# EAGLE board RelayBoard (EAGLE 9.6.2)
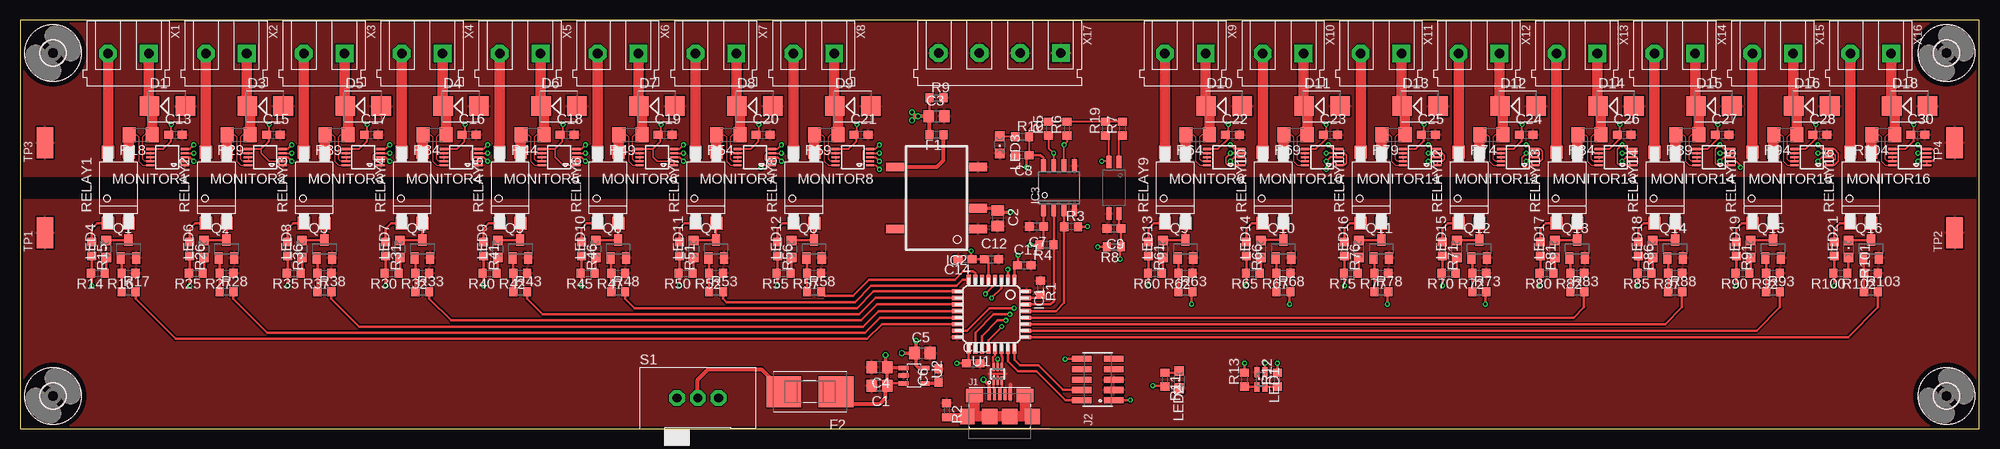
[diagram p9: board, top side]
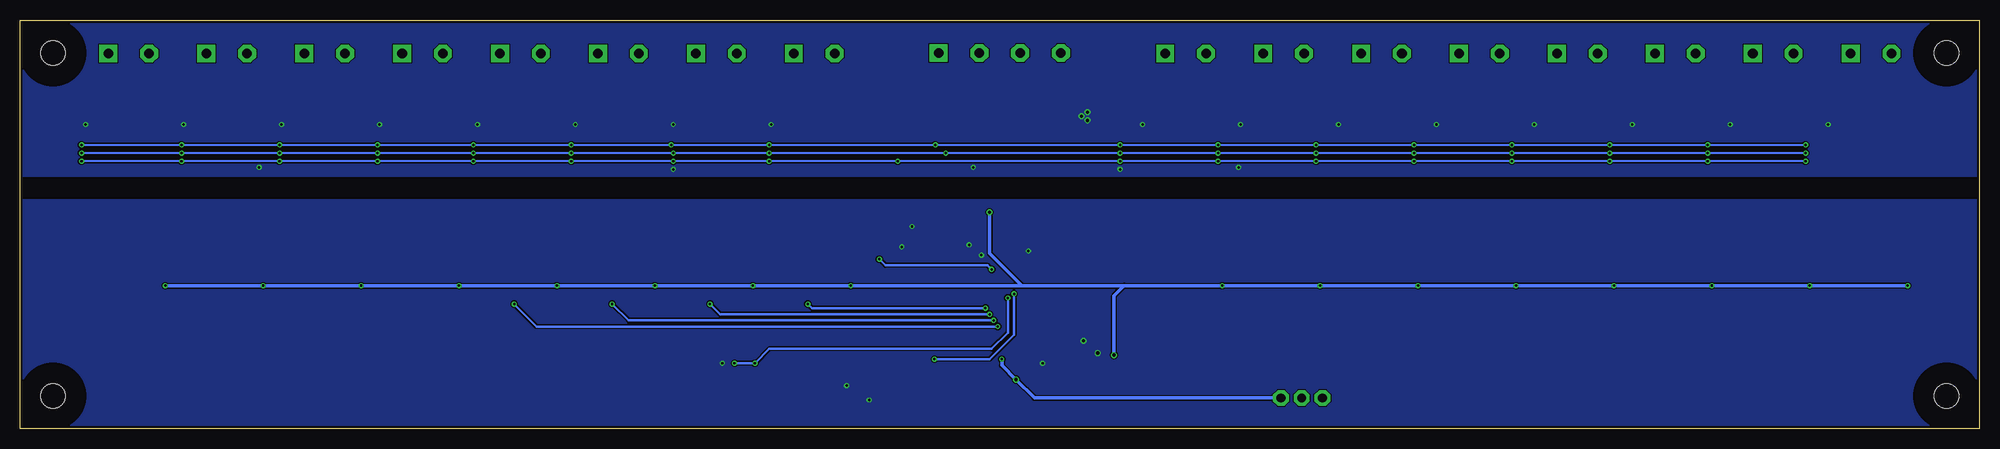
[diagram p10: board, bottom side, seen from below]

Size 240 x 50 mm. Coordinates in mm from the lower left corner, seen from the top.
Outline: 0,0 240,0 240,50 0,50 0,0
Copper layers (1*16): Top 0.035mm / dielectric 1.5mm / Bottom 0.035mm
Design rules "PCB-POOL Standard": minimum track width 0.15mm, minimum drill 0.3mm, track to track 0.15mm, track to pad 0.15mm, pad to pad 0.15mm, via to via 0.15mm, smd to smd 0.15mm, copper to edge 0.3mm, drill to drill 0.2mm, minimum pad ring 0.2mm, minimum via ring 0.15mm, stop-mask expansion 0.03mm, vias tented up to drill 0mil, thermal gap 0.2mm

## Footprints (pad centres in the part's own frame; a part is rotated, then mirrored left to right if it is on the bottom)
C0805 = smd 1.3 x 1.5: 1 -0.95,0; 2 0.95,0
C0603 = smd 1.1 x 1: 1 -0.85,0; 2 0.85,0
SMB = smd 2.4 x 2.4: A 2.2,0; C -2.2,0
R0603 = smd 1 x 1.1: 1 -0.85,0; 2 0.85,0
NANO2_SMF_FUSEBLOCK = smd 4.24 x 3.81: 1 -3.19,0; 2 3.19,0
3,0 = hole 3: 0,0
LQFP32 = smd 0.5 x 1.2: 1 -2.8,-4.25; 2 -2,-4.25; 3 -1.2,-4.25; 4 -0.4,-4.25; 5 0.4,-4.25; 6 1.2,-4.25; 7 2,-4.25; 8 2.8,-4.25; 17 2.8,4.25; 18 2,4.25; 19 1.2,4.25; 20 0.4,4.25; 21 -0.4,4.25; 22 -1.2,4.25; 23 -2,4.25; 24 -2.8,4.25 | smd 1.2 x 0.5: 9 4.25,-2.8; 10 4.25,-2; 11 4.25,-1.2; 12 4.25,-0.4; 13 4.25,0.4; 14 4.25,1.2; 15 4.25,2; 16 4.25,2.8; 25 -4.25,2.8; 26 -4.25,2; 27 -4.25,1.2; 28 -4.25,0.4; 29 -4.25,-0.4; 30 -4.25,-1.2; 31 -4.25,-2; 32 -4.25,-2.8
PESE1-M = smd 1.067 x 2.184: 1 -3.81,-5.08; 2 -1.27,-5.08; 4 3.81,-5.08; 5 3.81,5.08; 8 -3.81,5.08
SOIC8 = smd 1.55 x 0.6: 1 -2.7,1.905; 2 -2.7,0.635; 3 -2.7,-0.635; 4 -2.7,-1.905; 5 2.7,-1.905; 6 2.7,-0.635; 7 2.7,0.635; 8 2.7,1.905
4-MINI-FLAT = smd 1.524 x 0.61: 1 -3.175,0.635; 2 -3.175,-0.635; 3 3.175,-0.635; 4 3.175,0.635
HRS_ZX62-B-5PA(33) = smd 0.4 x 1.35: 1 -1.3,2.675; 2 -0.65,2.675; 3 0,2.675; 4 0.65,2.675; 5 1.3,2.675 | smd 2.1 x 1.6: SH1 -3.1,2.55; SH6 3.1,2.55 | smd 1.8 x 1.9: SH2 -4,0; SH5 4,0 | smd 1.9 x 1.9: SH3 -1.2,0; SH4 1.2,0
62101021021 = smd 0.75 x 2.4: 1 -2.54,-1.95; 2 -2.54,1.95; 3 -1.27,-1.95; 4 -1.27,1.95; 5 0,-1.95; 6 0,1.95; 7 1.27,-1.95; 8 1.27,1.95; 9 2.54,-1.95; 10 2.54,1.95
CHIPLEDX2 = smd 0.6 x 1.2: A1 -0.475,0.9; A2 0.475,0.9; C1 -0.475,-0.9; C2 0.475,-0.9
CHIPLED_0805 = smd 1.2 x 1.2: A 0,-1.05; C 0,1.05
MSOP10 = smd 0.25 x 1: 1 -1,-2.113; 2 -0.5,-2.113; 3 0,-2.113; 4 0.5,-2.113; 5 1,-2.113; 6 1,2.113; 7 0.5,2.113; 8 0,2.113; 9 -0.5,2.113; 10 -1,2.113
SOT23 = smd 1 x 1.4: 1 -0.95,-1.1; 2 0.95,-1.1; 3 0,1.1
R1206 = smd 1.6 x 1.803: 1 -1.422,0; 2 1.422,0
TP1/5 = smd 1.5 x 1.6: P$1 -1.27,-4.35; P$2 1.27,-4.35; P$3 1.27,4.35; P$4 -1.27,4.35
2533XN = drill 1.092 pad 1.93 octagon: 1 -2.54,0; 2 0,0; 3 2.54,0
3.8X2.03 = smd 3.8 x 2.03: TP 0,0
SOT-666 = smd 0.3 x 1: 1 -0.5,-0.81; 2 0,-0.81; 3 0.5,-0.81; 4 0.5,0.81; 5 0,0.81; 6 -0.5,0.81
SOT23-5 = smd 0.55 x 1.2: 1 -0.95,-1.3; 2 0,-1.3; 3 0.95,-1.3; 4 0.95,1.3; 5 -0.95,1.3
AKL055-2 = drill 1.168 pad 2.184 square: 1 2.525,4.045 | drill 1.168 pad 2.184 octagon: 2 7.525,4.045
AKL055-4 = drill 1.168 pad 2.184 square: 1 2.5,4 | drill 1.168 pad 2.184 octagon: 2 7.5,4; 3 12.5,4; 4 17.5,4

## Placement (x,y rotation side)
C1  10µ  [C0805]  105.25,5.25 180 top
C2  4.7µ  [C0805]  119.75,25.75 270 top
C3  10µ  [C0805]  112.25,38.25 0 top
C4  1µ  [C0805]  105.25,7.5 180 top
C5  4.7µ  [C0805]  110.5,9.25 0 top
C6  10n  [C0603]  112.5,6.5 90 top
C7  100n  [C0603]  124.5,24.75 180 top
C8  100n  [C0603]  122.75,33.5 180 top
C9  100n  [C0603]  134,24.5 180 top
C10  100n  [C0603]  116.75,8 0 top
C11  100n  [C0603]  123,20 0 top
C12  100n  [C0603]  119,20.75 0 top
C13  100n  [C0603]  19,36 0 top
C14  1µ  [C0603]  115.75,20.75 180 top
C15  100n  [C0603]  31,36 0 top
C16  100n  [C0603]  55,36 0 top
C17  100n  [C0603]  43,36 0 top
C18  100n  [C0603]  67,36 0 top
C19  100n  [C0603]  79,36 0 top
C20  100n  [C0603]  91,36 0 top
C21  100n  [C0603]  103,36 0 top
C22  100n  [C0603]  148.5,36 0 top
C23  100n  [C0603]  160.5,36 0 top
C24  100n  [C0603]  184.5,36 0 top
C25  100n  [C0603]  172.5,36 0 top
C26  100n  [C0603]  196.5,36 0 top
C27  100n  [C0603]  208.5,36 0 top
C28  100n  [C0603]  220.5,36 0 top
C30  100n  [C0603]  232.5,36 0 top
D1  60V, 2A  [SMB]  18,39.5 0 top
D3  60V, 2A  [SMB]  30,39.5 0 top
D4  60V, 2A  [SMB]  54,39.5 0 top
D5  60V, 2A  [SMB]  42,39.5 0 top
D6  60V, 2A  [SMB]  66,39.5 0 top
D7  60V, 2A  [SMB]  78,39.5 0 top
D8  60V, 2A  [SMB]  90,39.5 0 top
D9  60V, 2A  [SMB]  102,39.5 0 top
D10  60V, 2A  [SMB]  147.5,39.5 0 top
D11  60V, 2A  [SMB]  159.5,39.5 0 top
D12  60V, 2A  [SMB]  183.5,39.5 0 top
D13  60V, 2A  [SMB]  171.5,39.5 0 top
D14  60V, 2A  [SMB]  195.5,39.5 0 top
D15  60V, 2A  [SMB]  207.5,39.5 0 top
D16  60V, 2A  [SMB]  219.5,39.5 0 top
D18  60V, 2A  [SMB]  231.5,39.5 0 top
F1  250m  [R0603]  112.25,36 180 top
F2  SMF_OMNIBLOK_154.400  [NANO2_SMF_FUSEBLOCK]  96.75,4.5 180 top
H1  MOUNT-HOLE3.0  [3,0]  236,46 0 top
H2  MOUNT-HOLE3.0  [3,0]  236,4 0 top
H3  MOUNT-HOLE3.0  [3,0]  4,4 0 top
H4  MOUNT-HOLE3.0  [3,0]  4,46 0 top
IC1  STM32L412KBT6  [LQFP32]  119,14 180 top
IC2  PESE1-S5-S3-M  [PESE1-M]  112.25,28.25 90 top
IC3  ISO1541  [SOIC8]  127.25,29.5 90 top
IC4  HMHA281  [4-MINI-FLAT]  134,29.5 270 top
J1  ZX62-B-5PA(33)  [HRS_ZX62-B-5PA(33)]  120,1.5 0 top
J2  [62101021021]  132,6 90 top
LED1  DUAL0805  [CHIPLEDX2]  152,6 180 top
LED2  GREEN  [CHIPLED_0805]  142,6 180 top
LED3  GREEN  [CHIPLED_0805]  120,34.75 180 top
LED4  YELLOW  [CHIPLED_0805]  10.5,22 0 top
LED6  YELLOW  [CHIPLED_0805]  22.5,22 0 top
LED7  YELLOW  [CHIPLED_0805]  46.5,22 0 top
LED8  YELLOW  [CHIPLED_0805]  34.5,22 0 top
LED9  YELLOW  [CHIPLED_0805]  58.5,22 0 top
LED10  YELLOW  [CHIPLED_0805]  70.5,22 0 top
LED11  YELLOW  [CHIPLED_0805]  82.5,22 0 top
LED12  YELLOW  [CHIPLED_0805]  94.5,22 0 top
LED13  YELLOW  [CHIPLED_0805]  140,22 0 top
LED14  YELLOW  [CHIPLED_0805]  152,22 0 top
LED15  YELLOW  [CHIPLED_0805]  176,22 0 top
LED16  YELLOW  [CHIPLED_0805]  164,22 0 top
LED17  YELLOW  [CHIPLED_0805]  188,22 0 top
LED18  YELLOW  [CHIPLED_0805]  200,22 0 top
LED19  YELLOW  [CHIPLED_0805]  212,22 0 top
LED21  YELLOW  [CHIPLED_0805]  224,22 0 top
MONITOR1  INA226  [MSOP10]  18,33.25 90 top
MONITOR2  INA226  [MSOP10]  30,33.25 90 top
MONITOR3  INA226  [MSOP10]  42,33.25 90 top
MONITOR4  INA226  [MSOP10]  54,33.25 90 top
MONITOR5  INA226  [MSOP10]  66,33.25 90 top
MONITOR6  INA226  [MSOP10]  78,33.25 90 top
MONITOR7  INA226  [MSOP10]  90,33.25 90 top
MONITOR8  INA226  [MSOP10]  102,33.25 90 top
MONITOR9  INA226  [MSOP10]  147.5,33.25 90 top
MONITOR10  INA226  [MSOP10]  159.5,33.25 90 top
MONITOR11  INA226  [MSOP10]  171.5,33.25 90 top
MONITOR12  INA226  [MSOP10]  183.5,33.25 90 top
MONITOR13  INA226  [MSOP10]  195.5,33.25 90 top
MONITOR14  INA226  [MSOP10]  207.5,33.25 90 top
MONITOR15  INA226  [MSOP10]  219.5,33.25 90 top
MONITOR16  INA226  [MSOP10]  231.5,33.25 90 top
Q1  BSS138  [SOT23]  13.25,22 0 top
Q2  BSS138  [SOT23]  25.25,22 0 top
Q3  BSS138  [SOT23]  37.25,22 0 top
Q4  BSS138  [SOT23]  49.25,22 0 top
Q5  BSS138  [SOT23]  61.25,22 0 top
Q6  BSS138  [SOT23]  73.25,22 0 top
Q7  BSS138  [SOT23]  85.25,22 0 top
Q8  BSS138  [SOT23]  97.25,22 0 top
Q9  BSS138  [SOT23]  142.75,22 0 top
Q10  BSS138  [SOT23]  154.75,22 0 top
Q11  BSS138  [SOT23]  166.75,22 0 top
Q12  BSS138  [SOT23]  178.75,22 0 top
Q13  BSS138  [SOT23]  190.75,22 0 top
Q14  BSS138  [SOT23]  202.75,22 0 top
Q15  BSS138  [SOT23]  214.75,22 0 top
Q16  BSS138  [SOT23]  226.75,22 0 top
R1  10k  [R0603]  125,17.25 270 top
R2  1M  [R0603]  113.5,2.25 270 top
R3  4.7k  [R0603]  128.75,24.75 0 top
R4  4.7k  [R0603]  125.75,22.5 180 top
R5  4.7k  [R0603]  126,36.75 90 top
R6  4.7k  [R0603]  128.25,36.75 90 top
R7  200  [R0603]  135.05,36.75 90 top
R8  10k  [R0603]  134,22.25 180 top
R9  100  [R0603]  112.25,40.5 0 top
R10  200  [R0603]  122.75,35.75 0 top
R11  200  [R0603]  140.25,6 270 top
R12  200  [R0603]  154,6 90 top
R13  200  [R0603]  150,6 90 top
R14  499  [R0603]  9.5,19 180 top
R15  499  [R0603]  8.75,22 270 top
R16  10k  [R0603]  13.25,19 180 top
R17  100  [R0603]  13.25,16.75 0 top
R18  25m  [R1206]  14.75,36 180 top
R19  10k  [R0603]  132.95,36.75 90 top
R25  499  [R0603]  21.5,19 180 top
R26  499  [R0603]  20.75,22 270 top
R27  10k  [R0603]  25.25,19 180 top
R28  100  [R0603]  25.25,16.75 0 top
R29  25m  [R1206]  26.75,36 180 top
R30  499  [R0603]  45.5,19 180 top
R31  499  [R0603]  44.75,22 270 top
R32  10k  [R0603]  49.25,19 180 top
R33  100  [R0603]  49.25,16.75 0 top
R34  25m  [R1206]  50.75,36 180 top
R35  499  [R0603]  33.5,19 180 top
R36  499  [R0603]  32.75,22 270 top
R37  10k  [R0603]  37.25,19 180 top
R38  100  [R0603]  37.25,16.75 0 top
R39  25m  [R1206]  38.75,36 180 top
R40  499  [R0603]  57.5,19 180 top
R41  499  [R0603]  56.75,22 270 top
R42  10k  [R0603]  61.25,19 180 top
R43  100  [R0603]  61.25,16.75 0 top
R44  25m  [R1206]  62.75,36 180 top
R45  499  [R0603]  69.5,19 180 top
R46  499  [R0603]  68.75,22 270 top
R47  10k  [R0603]  73.25,19 180 top
R48  100  [R0603]  73.25,16.75 0 top
R49  25m  [R1206]  74.75,36 180 top
R50  499  [R0603]  81.5,19 180 top
R51  499  [R0603]  80.75,22 270 top
R52  10k  [R0603]  85.25,19 180 top
R53  100  [R0603]  85.25,16.75 0 top
R54  25m  [R1206]  86.75,36 180 top
R55  499  [R0603]  93.5,19 180 top
R56  499  [R0603]  92.75,22 270 top
R57  10k  [R0603]  97.25,19 180 top
R58  100  [R0603]  97.25,16.75 0 top
R59  25m  [R1206]  98.75,36 180 top
R60  499  [R0603]  139,19 180 top
R61  499  [R0603]  138.25,22 270 top
R62  10k  [R0603]  142.75,19 180 top
R63  100  [R0603]  142.75,16.75 0 top
R64  25m  [R1206]  144.25,36 180 top
R65  499  [R0603]  151,19 180 top
R66  499  [R0603]  150.25,22 270 top
R67  10k  [R0603]  154.75,19 180 top
R68  100  [R0603]  154.75,16.75 0 top
R69  25m  [R1206]  156.25,36 180 top
R70  499  [R0603]  175,19 180 top
R71  499  [R0603]  174.25,22 270 top
R72  10k  [R0603]  178.75,19 180 top
R73  100  [R0603]  178.75,16.75 0 top
R74  25m  [R1206]  180.25,36 180 top
R75  499  [R0603]  163,19 180 top
R76  499  [R0603]  162.25,22 270 top
R77  10k  [R0603]  166.75,19 180 top
R78  100  [R0603]  166.75,16.75 0 top
R79  25m  [R1206]  168.25,36 180 top
R80  499  [R0603]  187,19 180 top
R81  499  [R0603]  186.25,22 270 top
R82  10k  [R0603]  190.75,19 180 top
R83  100  [R0603]  190.75,16.75 0 top
R84  25m  [R1206]  192.25,36 180 top
R85  499  [R0603]  199,19 180 top
R86  499  [R0603]  198.25,22 270 top
R87  10k  [R0603]  202.75,19 180 top
R88  100  [R0603]  202.75,16.75 0 top
R89  25m  [R1206]  204.25,36 180 top
R90  499  [R0603]  211,19 180 top
R91  499  [R0603]  210.25,22 270 top
R92  10k  [R0603]  214.75,19 180 top
R93  100  [R0603]  214.75,16.75 0 top
R94  25m  [R1206]  216.25,36 180 top
R100  499  [R0603]  223,19 180 top
R101  499  [R0603]  222.25,22 270 top
R102  10k  [R0603]  226.75,19 180 top
R103  100  [R0603]  226.75,16.75 0 top
R104  25m  [R1206]  228.25,36 180 top
RELAY1  TLP241A(LF1,TP1)  [TP1/5]  12,29.5 0 top
RELAY2  TLP241A(LF1,TP1)  [TP1/5]  24,29.5 0 top
RELAY3  TLP241A(LF1,TP1)  [TP1/5]  36,29.5 0 top
RELAY4  TLP241A(LF1,TP1)  [TP1/5]  48,29.5 0 top
RELAY5  TLP241A(LF1,TP1)  [TP1/5]  60,29.5 0 top
RELAY6  TLP241A(LF1,TP1)  [TP1/5]  72,29.5 0 top
RELAY7  TLP241A(LF1,TP1)  [TP1/5]  84,29.5 0 top
RELAY8  TLP241A(LF1,TP1)  [TP1/5]  96,29.5 0 top
RELAY9  TLP241A(LF1,TP1)  [TP1/5]  141.5,29.5 0 top
RELAY10  TLP241A(LF1,TP1)  [TP1/5]  153.5,29.5 0 top
RELAY11  TLP241A(LF1,TP1)  [TP1/5]  165.5,29.5 0 top
RELAY12  TLP241A(LF1,TP1)  [TP1/5]  177.5,29.5 0 top
RELAY13  TLP241A(LF1,TP1)  [TP1/5]  189.5,29.5 0 top
RELAY14  TLP241A(LF1,TP1)  [TP1/5]  201.5,29.5 0 top
RELAY15  TLP241A(LF1,TP1)  [TP1/5]  213.5,29.5 0 top
RELAY16  TLP241A(LF1,TP1)  [TP1/5]  225.5,29.5 0 top
S1  25336N  [2533XN]  83,3.75 0 top
TP1  TP3.8X2.03  [3.8X2.03]  3,24 90 top
TP2  TP3.8X2.03  [3.8X2.03]  237,24 90 top
TP3  TP3.8X2.03  [3.8X2.03]  3,35 90 top
TP4  TP3.8X2.03  [3.8X2.03]  237,35 90 top
U1  USBLC6-2P6  [SOT-666]  119.75,6.7 0 top
U2  LP2985IM5-3.3  [SOT23-5]  109.5,6.5 270 top
X1  AKL055-2  [AKL055-2]  18.25,50 180 top
X2  AKL055-2  [AKL055-2]  30.25,50 180 top
X3  AKL055-2  [AKL055-2]  42.25,50 180 top
X4  AKL055-2  [AKL055-2]  54.25,50 180 top
X5  AKL055-2  [AKL055-2]  66.25,50 180 top
X6  AKL055-2  [AKL055-2]  78.25,50 180 top
X7  AKL055-2  [AKL055-2]  90.25,50 180 top
X8  AKL055-2  [AKL055-2]  102.25,50 180 top
X9  AKL055-2  [AKL055-2]  147.75,50 180 top
X10  AKL055-2  [AKL055-2]  159.75,50 180 top
X11  AKL055-2  [AKL055-2]  171.75,50 180 top
X12  AKL055-2  [AKL055-2]  183.75,50 180 top
X13  AKL055-2  [AKL055-2]  195.75,50 180 top
X14  AKL055-2  [AKL055-2]  207.75,50 180 top
X15  AKL055-2  [AKL055-2]  219.75,50 180 top
X16  AKL055-2  [AKL055-2]  231.75,50 180 top
X17  AKL055-4  [AKL055-4]  130,50 180 top

## Tracks (layer width: path | path; a pad name or v marks a point on that pad's centre or on a via)
!ALERT  (via drill 0.3)
  Top 0.305: IC4.4 134.63,24.71 C9.1 R8.1 134.75,22.15 v134.75,20.75 | IC1.2 v121,19.5
  Bottom 0.305: v121,19.5 121.5,20 134,20 v134.75,20.75
!ALERTISO  (via drill 0.3)
  Top 0.254: MONITOR8.3 104.75,33.25 v105.25,32.75 | MONITOR1.3 20.75,33.25 v21.25,32.75 | v232.5,32.75 233,33.25 MONITOR16.3 | MONITOR15.3 220.75,33.25 v220.25,32.75 | MONITOR14.3 208.75,33.25 v208.25,32.75 | MONITOR13.3 196.75,33.25 v196.25,32.75 | MONITOR12.3 185,33.25 v184.5,32.75 | MONITOR11.3 173,33.25 v172.5,32.75 | MONITOR10.3 160.5,33.25 v160,32.75 | MONITOR9.3 148.75,33.25 v148.25,32.75 | MONITOR7.3 92.75,33.25 v93.25,32.75 | MONITOR6.3 80.75,33.25 v81.25,32.75 | MONITOR5.3 68.75,33.25 v69.25,32.75 | MONITOR4.3 56.75,33.25 v57.25,32.75 | MONITOR3.3 44.75,33.25 v45.25,32.75 | MONITOR2.3 32.75,33.25 v33.25,32.75 | R19.1 133.37,35.48 IC4.2 133.29,32.75 v132.5,32.75
  Bottom 0.254: v21.25,32.75 v33.25,32.75 v45.25,32.75 v57.25,32.75 v69.25,32.75 v81.25,32.75 v93.25,32.75 v105.25,32.75 v132.5,32.75 v148.25,32.75 v160,32.75 v172.5,32.75 v184.5,32.75 v196.25,32.75 v208.25,32.75 v220.25,32.75 v232.5,32.75
!NRST  (via drill 0.3)
  Top 0.305: IC1.4 119.4,17.65 v118.25,16.5 | v128,8.5 128.04,8.54 J2.10
  Bottom 0.305: v118.25,16.5 118.25,11.5 121.25,8.5 v128,8.5
GND
  Top 0.305: U1.2 119.75,6.71 | 119.75,6.71 120.75,6.71 | 119.75,6.71 118.71,6.71
  Top 0.406: J1.5 121.3,5.45
  pour Top: 0,0 0,28 240,28 240,0
GNDISO
  pour Top: 0,50 0,31 240,31 240,50
LOAD1
  Top 0.15: R18.1 15.25,36 15,35.75 15,33 15.25,32.75 MONITOR1.9 MONITOR1.8
  Top 1.27: X1.1 15.72,39.58 D1.C 16.17,39.13 R18.1
LOAD2
  Top 0.15: R29.1 27.25,36 27,35.75 27,33 27.25,32.75 MONITOR2.9 MONITOR2.8
  Top 1.27: R29.1 28.17,39.13 D3.C 27.73,39.58 X2.1
LOAD3
  Top 0.15: R39.1 39.25,36 39,35.75 39,33 39.25,32.75 MONITOR3.9 MONITOR3.8
  Top 1.27: X3.1 39.73,39.58 D5.C 40.17,39.13 R39.1
LOAD4
  Top 0.15: R34.1 51.25,36 51,35.75 51,33 51.25,32.75 MONITOR4.9 MONITOR4.8
  Top 1.27: R34.1 52.17,39.13 D4.C 51.73,39.58 X4.1
LOAD5
  Top 0.15: R44.1 63.25,36 63,35.75 63,33 63.25,32.75 MONITOR5.9 MONITOR5.8
  Top 1.27: X5.1 63.73,39.58 D6.C 64.17,39.13 R44.1
LOAD6
  Top 0.15: R49.1 75.25,36 75,35.75 75,33 75.25,32.75 MONITOR6.9 MONITOR6.8
  Top 1.27: X6.1 75.72,39.58 D7.C 76.17,39.13 R49.1
LOAD7
  Top 0.15: R54.1 87.25,36 87,35.75 87,33 87.25,32.75 MONITOR7.9 MONITOR7.8
  Top 1.27: X7.1 87.72,39.58 D8.C 88.17,39.13 R54.1
LOAD8
  Top 0.15: R59.1 99.25,36 99,35.75 99,33 99.25,32.75 MONITOR8.9 MONITOR8.8
  Top 1.27: R59.1 100.17,39.13 D9.C 99.72,39.58 X8.1
LOAD9
  Top 0.15: R64.1 144.75,36 144.5,35.75 144.5,33 144.75,32.75 MONITOR9.9 MONITOR9.8
  Top 1.27: R64.1 145.67,39.13 D10.C 145.22,39.58 X9.1
LOAD10
  Top 0.15: R69.1 156.75,36 156.5,35.75 156.5,33 156.75,32.75 MONITOR10.9 MONITOR10.8
  Top 1.27: X10.1 157.22,39.58 D11.C 157.67,39.13 R69.1
LOAD11
  Top 0.15: R79.1 168.75,36 168.5,35.75 168.5,33 168.75,32.75 MONITOR11.9 MONITOR11.8
  Top 1.27: X11.1 169.22,39.58 D13.C 169.67,39.13 R79.1
LOAD12
  Top 0.15: R74.1 180.75,36 180.5,35.75 180.5,33 180.75,32.75 MONITOR12.9 MONITOR12.8
  Top 1.27: X12.1 181.22,39.58 D12.C 181.67,39.13 R74.1
LOAD13
  Top 0.15: R84.1 192.75,36 192.5,35.75 192.5,33 192.75,32.75 MONITOR13.9 MONITOR13.8
  Top 1.27: R84.1 193.67,39.13 D14.C 193.22,39.58 X13.1
LOAD14
  Top 0.15: R89.1 204.75,36 204.5,35.75 204.5,33 204.75,32.75 MONITOR14.9 MONITOR14.8
  Top 1.27: R89.1 205.67,39.13 D15.C 205.22,39.58 X14.1
LOAD15
  Top 0.15: R94.1 216.75,36 216.5,35.75 216.5,33 216.75,32.75 MONITOR15.9 MONITOR15.8
  Top 1.27: X15.1 217.22,39.58 D16.C 217.67,39.13 R94.1
LOAD16
  Top 0.15: R104.1 228.75,36 228.5,35.75 228.5,33 228.75,32.75 MONITOR16.9 MONITOR16.8
  Top 1.27: R104.1 229.67,39.13 D18.C 229.22,39.58 X16.1
N$1
  Top 0.305: J1.2 119.35,4.9 119.25,5 U1.1
N$2
  Top 0.305: J1.3 120,4.86 120.25,5.11 U1.3
N$3
  Top 1.016: R2.2 115.9,1.4 J1.SH2
  Top 1.27: J1.SH1 116.9,2.4 J1.SH2 J1.SH3 J1.SH4 J1.SH5 123.1,2.4 J1.SH6
N$4
  Top 0.254: IC4.1 134.63,35.48 R7.1
N$5
  Top 0.406: U2.4 112.4,5.55 C6.1
N$6
  Top 0.305: IC1.31 125,16 R1.2
N$7
  Top 0.254: LED3.A 121.85,35.8 R10.1
N$8
  Top 0.305: R11.1 141.8,6.85 LED2.A
N$9
  Top 0.305: LED1.A2 150.05,5.1 R13.1
N$10
  Top 0.305: LED1.A1 152.53,5.15 R12.1
N$11
  Top 0.305: LED4.A 10.5,19.15 R14.1
N$12  (via drill 0.3, 0.4)
  Top 0.305: U1.5 v119.75,8.5
  Top 0.406: J1.1 118.7,5.3 v118,6
  Bottom 0.406: S1.3 115.75,3.75 v118,6 119.75,7.75 v119.75,8.5
N$13
  Top 0.305: RELAY1.P$2 13.25,25.13 Q1.3 10.55,23.1 LED4.C
N$14
  Top 0.305: R17.1 R16.2 12.4,20.8 Q1.1
N$15
  Top 0.15: R18.2 14.25,36 14.5,35.75 14.5,32.75 15,32.25 MONITOR1.10
  Top 1.27: RELAY1.P$3 13.27,35.94 R18.2
N$16
  Top 0.305: R15.1 8.75,24.5 9.4,25.15 RELAY1.P$1
N$17
  Top 0.508: S1.2 83,6 84.25,7.25 90.81,7.25 F2.2
N$18
  Top 0.508: IC2.5 112.31,32.06 113.1,32.85 F1.1
N$25
  Top 0.305: LED6.A 22.5,19.15 R25.1
N$26
  Top 0.305: RELAY2.P$2 25.25,25.13 Q2.3 22.55,23.1 LED6.C
N$27
  Top 0.305: R28.1 R27.2 24.4,20.8 Q2.1
N$28
  Top 0.15: R29.2 26.25,36 26.5,35.75 26.5,32.75 27,32.25 MONITOR2.10
  Top 1.27: RELAY2.P$3 25.27,35.94 R29.2
N$31
  Top 0.305: R26.1 20.75,24.5 21.4,25.15 RELAY2.P$1
N$32
  Top 0.305: LED7.A 46.5,19.15 R30.1
N$33
  Top 0.305: LED7.C 46.55,23.1 Q4.3 49.25,25.13 RELAY4.P$2
N$34
  Top 0.305: R33.1 R32.2 48.4,20.8 Q4.1
N$35
  Top 0.15: R34.2 50.25,36 50.5,35.75 50.5,32.75 51,32.25 MONITOR4.10
  Top 1.27: RELAY4.P$3 49.27,35.94 R34.2
N$38
  Top 0.305: R31.1 44.75,24.5 45.4,25.15 RELAY4.P$1
N$39
  Top 0.305: LED8.A 34.5,19.15 R35.1
N$40
  Top 0.305: RELAY3.P$2 37.27,23.12 Q3.3 34.55,23.1 LED8.C
N$41
  Top 0.305: R38.1 R37.2 36.4,20.8 Q3.1
N$42
  Top 0.15: R39.2 38.25,36 38.5,35.75 38.5,32.75 39,32.25 MONITOR3.10
  Top 1.27: RELAY3.P$3 37.27,35.94 R39.2
N$45
  Top 0.305: R36.1 32.75,24.5 33.4,25.15 RELAY3.P$1
N$46
  Top 0.305: LED9.A 58.5,19.15 R40.1
N$47
  Top 0.305: LED9.C 58.55,23.1 Q5.3 61.25,25.13 RELAY5.P$2
N$48
  Top 0.305: R43.1 R42.2 60.4,20.8 Q5.1
N$49
  Top 0.15: R44.2 62.25,36 62.5,35.75 62.5,32.75 63,32.25 MONITOR5.10
  Top 1.27: RELAY5.P$3 61.27,35.94 R44.2
N$52
  Top 0.305: R41.1 56.75,24.5 57.4,25.15 RELAY5.P$1
N$53
  Top 0.305: LED10.A 70.5,19.15 R45.1
N$54
  Top 0.305: RELAY6.P$2 73.25,25.13 Q6.3 70.55,23.1 LED10.C
N$55
  Top 0.305: R48.1 R47.2 72.4,20.8 Q6.1
N$56
  Top 0.15: R49.2 74.25,36 74.5,35.75 74.5,32.75 75,32.25 MONITOR6.10
  Top 1.27: RELAY6.P$3 73.27,35.94 R49.2
N$59
  Top 0.305: R46.1 68.75,24.5 69.4,25.15 RELAY6.P$1
N$60
  Top 0.305: LED11.A 82.5,19.15 R50.1
N$61
  Top 0.305: RELAY7.P$2 85.25,25.13 Q7.3 82.55,23.1 LED11.C
N$62
  Top 0.305: R53.1 R52.2 84.4,20.8 Q7.1
N$63
  Top 0.15: R54.2 86.25,36 86.5,35.75 86.5,32.75 87,32.25 MONITOR7.10
  Top 1.27: RELAY7.P$3 85.27,35.94 R54.2
N$66
  Top 0.305: R51.1 80.75,24.5 81.4,25.15 RELAY7.P$1
N$67
  Top 0.305: LED12.A 94.5,19.15 R55.1
N$68
  Top 0.305: RELAY8.P$2 97.27,23.12 Q8.3 94.55,23.1 LED12.C
N$69
  Top 0.305: R58.1 R57.2 96.4,20.8 Q8.1
N$70
  Top 0.15: R59.2 98.25,36 98.5,35.75 98.5,32.75 99,32.25 MONITOR8.10
  Top 1.27: RELAY8.P$3 97.27,35.94 R59.2
N$73
  Top 0.305: R56.1 92.75,24.5 93.4,25.15 RELAY8.P$1
N$74
  Top 0.305: LED13.A 140,19.15 R60.1
N$75
  Top 0.305: RELAY9.P$2 142.77,23.12 Q9.3 140.05,23.1 LED13.C
N$76
  Top 0.305: R63.1 R62.2 141.9,20.8 Q9.1
N$77
  Top 0.15: R64.2 143.75,36 144,35.75 144,32.75 144.5,32.25 MONITOR9.10
  Top 1.27: RELAY9.P$3 142.77,35.94 R64.2
N$80
  Top 0.305: R61.1 138.25,24.5 138.9,25.15 RELAY9.P$1
N$81
  Top 0.305: LED14.A 152,19.15 R65.1
N$82
  Top 0.305: RELAY10.P$2 154.77,23.12 | 154.77,23.12 Q10.3 | LED14.C 152.07,23.12 154.77,23.12
N$83
  Top 0.305: R68.1 R67.2 153.9,20.8 Q10.1
N$84
  Top 0.15: R69.2 155.75,36 156,35.75 156,32.75 156.5,32.25 MONITOR10.10
  Top 1.27: RELAY10.P$3 154.77,35.94 R69.2
N$87
  Top 0.305: R66.1 150.25,24.5 150.9,25.15 RELAY10.P$1
N$88
  Top 0.305: LED15.A 176,19.15 R70.1
N$89
  Top 0.305: LED15.C 176.05,23.1 Q12.3 178.77,23.12 RELAY12.P$2
N$90
  Top 0.305: R73.1 R72.2 177.9,20.8 Q12.1
N$91
  Top 0.15: R74.2 179.75,36 180,35.75 180,32.75 180.5,32.25 MONITOR12.10
  Top 1.27: RELAY12.P$3 178.77,35.94 R74.2
N$94
  Top 0.305: R71.1 174.25,24.5 174.9,25.15 RELAY12.P$1
N$95
  Top 0.305: LED16.A 164,19.15 R75.1
N$96
  Top 0.305: RELAY11.P$2 166.77,23.12 Q11.3 164.05,23.1 LED16.C
N$97
  Top 0.305: R78.1 R77.2 165.9,20.8 Q11.1
N$98
  Top 0.15: R79.2 167.75,36 168,35.75 168,32.75 168.5,32.25 MONITOR11.10
  Top 1.27: RELAY11.P$3 166.77,35.94 R79.2
N$101
  Top 0.305: R76.1 162.25,24.5 162.9,25.15 RELAY11.P$1
N$102
  Top 0.305: LED17.A 188,19.15 R80.1
N$103
  Top 0.305: RELAY13.P$2 190.77,23.12 Q13.3 188.05,23.1 LED17.C
N$104
  Top 0.305: R83.1 R82.2 189.9,20.8 Q13.1
N$105
  Top 0.15: R84.2 191.75,36 192,35.75 192,32.75 192.5,32.25 MONITOR13.10
  Top 1.27: RELAY13.P$3 190.77,35.94 R84.2
N$108
  Top 0.305: R81.1 186.25,24.5 186.9,25.15 RELAY13.P$1
N$109
  Top 0.305: LED18.A 200,19.15 R85.1
N$110
  Top 0.305: RELAY14.P$2 202.77,23.12 Q14.3 200.05,23.1 LED18.C
N$111
  Top 0.305: R88.1 R87.2 201.9,20.8 Q14.1
N$112
  Top 0.15: R89.2 203.75,36 204,35.75 204,32.75 204.5,32.25 MONITOR14.10
  Top 1.27: RELAY14.P$3 202.77,35.94 R89.2
N$115
  Top 0.305: R86.1 198.25,24.5 198.9,25.15 RELAY14.P$1
N$116
  Top 0.305: LED19.A 212,19.15 R90.1
N$117
  Top 0.305: RELAY15.P$2 214.77,23.12 Q15.3 212.05,23.1 LED19.C
N$118
  Top 0.305: R93.1 R92.2 213.9,20.8 Q15.1
N$119
  Top 0.15: R94.2 215.75,36 216,35.75 216,32.75 216.5,32.25 MONITOR15.10
  Top 1.27: RELAY15.P$3 214.77,35.94 R94.2
N$122
  Top 0.305: R91.1 210.25,24.5 210.9,25.15 RELAY15.P$1
N$130
  Top 0.305: LED21.A 224,19.15 R100.1
N$131
  Top 0.305: RELAY16.P$2 226.77,23.12 Q16.3 224.05,23.1 LED21.C
N$132
  Top 0.305: R103.1 R102.2 225.9,20.8 Q16.1
N$133
  Top 0.15: R104.2 227.75,36 228,35.75 228,32.75 228.5,32.25 MONITOR16.10
  Top 1.27: RELAY16.P$3 226.77,35.94 R104.2
N$136
  Top 0.305: R101.1 222.25,24.5 222.9,25.15 RELAY16.P$1
RELAY1
  Top 0.305: IC1.14 105.55,12.8 103.75,11 19,11 14.1,15.9 R17.2
RELAY2
  Top 0.305: IC1.13 105.35,13.6 103.5,11.75 30.25,11.75 26.1,15.9 R28.2
RELAY3
  Top 0.305: IC1.12 105.15,14.4 103.25,12.5 41.5,12.5 38.1,15.9 R38.2
RELAY4
  Top 0.305: IC1.11 104.95,15.2 103,13.25 52.75,13.25 50.1,15.9 R33.2
RELAY5
  Top 0.305: IC1.10 104.75,16 102.75,14 64,14 62.1,15.9 R43.2
RELAY6
  Top 0.305: IC1.9 104.55,16.8 102.5,14.75 75.25,14.75 74.1,15.9 R48.2
RELAY7
  Top 0.305: IC1.8 115.45,18.25 114.7,17.5 104.25,17.5 102.25,15.5 86.5,15.5 86.1,15.9 R53.2
RELAY8
  Top 0.305: R58.2 98.6,16.25 102,16.25 104,18.25 114.5,18.25 115.5,19.25 116.75,19.25 117,19 IC1.7
RELAY9  (via drill 0.3)
  Top 0.305: IC1.15 116,12 118.75,14.75 v121.75,14.75 | v143.5,15.25 143.5,16.65 R63.2
  Bottom 0.305: v121.75,14.75 143,14.75 v143.5,15.25
RELAY10  (via drill 0.3)
  Top 0.305: IC1.18 117,11.75 119.25,14 v121.25,14 | v155.5,15.25 155.5,16.65 R68.2
  Bottom 0.305: v121.25,14 154.25,14 v155.5,15.25
RELAY11  (via drill 0.3)
  Top 0.305: IC1.19 117.8,11.3 119.75,13.25 v120.75,13.25 | v167.5,15.25 167.5,16.65 R78.2
  Bottom 0.305: v120.75,13.25 165.5,13.25 v167.5,15.25
RELAY12  (via drill 0.3)
  Top 0.305: IC1.20 118.6,10.85 v120.25,12.5 | v179.5,15.25 179.5,16.65 R73.2
  Bottom 0.305: v120.25,12.5 176.75,12.5 v179.5,15.25
RELAY13
  Top 0.305: IC1.28 190.35,13.6 191.6,14.85 R83.2
RELAY14
  Top 0.305: IC1.27 201.55,12.8 203.6,14.85 R88.2
RELAY15
  Top 0.305: IC1.26 212.75,12 215.6,14.85 R93.2
RELAY16
  Top 0.305: IC1.25 223.95,11.2 227.6,14.85 R103.2
SCL
  Top 0.305: IC3.3 127.89,24.75 | 127.89,24.75 R3.1 | IC1.29 126.9,14.4 127.89,15.38 127.89,24.75
SCLISO  (via drill 0.3)
  Top 0.203: MONITOR4.2 55.5,32.75 55.25,33 55.25,34 55.5,34.25 MONITOR4.5 | MONITOR8.2 103.5,32.75 103.25,33 103.25,34 103.5,34.25 MONITOR8.5 | MONITOR16.1 MONITOR16.2 234.25,32.75 234.5,33 234.5,34 234.25,34.25 MONITOR16.5 | MONITOR12.2 186.25,32.75 186.5,33 186.5,34 186.25,34.25 MONITOR12.5 | v196.25,34.75 195.7,34.2 195.7,32.52 196.02,32.2 196.48,32.2 196.53,32.25 MONITOR13.1 | MONITOR14.1 208.53,32.25 208.48,32.2 208.02,32.2 207.7,32.52 207.7,34.2 v208.25,34.75 | MONITOR15.5 222.25,34.25 222.75,33.75 222.75,32.75 222.25,32.25 MONITOR15.1
  Top 0.254: IC3.6 v127.89,34.75 128.25,35.12 R6.1 | MONITOR1.5 20.75,34.25 v21.25,34.75 | MONITOR2.5 32.75,34.25 v33.25,34.75 | MONITOR3.5 44.75,34.25 v45.25,34.75 | MONITOR4.5 56.75,34.25 v57.25,34.75 | MONITOR5.5 68.75,34.25 v69.25,34.75 | MONITOR6.5 80.75,34.25 v81.25,34.75 | MONITOR7.5 92.75,34.25 v93.25,34.75 | MONITOR8.5 104.75,34.25 v105.25,34.75 | MONITOR9.5 148.75,34.25 v148.25,34.75 | MONITOR10.5 160.75,34.25 v160.25,34.75 | MONITOR11.5 173,34.25 v172.5,34.75 | MONITOR12.5 185,34.25 v184.5,34.75 | MONITOR13.5 196.75,34.25 v196.25,34.75 | MONITOR14.5 208.75,34.25 v208.25,34.75 | MONITOR15.5 220.75,34.25 v220.25,34.75 | MONITOR16.5 233,34.25 v232.5,34.75
  Bottom 0.254: v232.5,34.75 v220.25,34.75 v208.25,34.75 v196.25,34.75 v184.5,34.75 v172.5,34.75 v160.25,34.75 v148.25,34.75 v127.89,34.75 v105.25,34.75 v93.25,34.75 v81.25,34.75 v69.25,34.75 v57.25,34.75 v45.25,34.75 v33.25,34.75 v21.25,34.75
SDA
  Top 0.305: IC3.2 126.61,22.5 | 126.61,22.5 R4.1 | IC1.30 126.2,15.2 126.61,15.62 126.61,22.5
SDAISO  (via drill 0.3)
  Top 0.203: MONITOR3.2 43.5,32.75 43.25,33 43.25,33.5 43.5,33.75 MONITOR3.4 | MONITOR7.2 91.5,32.75 91.25,33 91.25,33.5 91.5,33.75 MONITOR7.4 | MONITOR11.1 MONITOR11.2 174.25,32.75 174.5,33 174.5,33.5 174.25,33.75 MONITOR11.4 | MONITOR10.1 162.25,32.25 162.5,32.5 162.5,33.5 162.25,33.75 MONITOR10.4 | MONITOR12.1 185,32.25 184.75,32 184.25,32 183.95,32.3 183.95,33.2 v184.5,33.75 | MONITOR9.1 148.53,32.25 148.48,32.2 148.02,32.2 147.7,32.52 147.7,33.2 v148.25,33.75 | MONITOR15.2 222.09,32.75 222.37,33.02 222.37,33.48 222.09,33.75 MONITOR15.4
  Top 0.254: MONITOR1.4 v21.25,33.75 | v232.5,33.75 MONITOR16.4 | MONITOR15.4 v220.25,33.75 | MONITOR14.4 v208.25,33.75 | MONITOR13.4 v196.25,33.75 | MONITOR12.4 v184.5,33.75 | MONITOR11.4 v172.5,33.75 | MONITOR10.4 v160,33.75 | MONITOR9.4 v148.25,33.75 | MONITOR2.4 v33.25,33.75 | MONITOR3.4 v45.25,33.75 | MONITOR4.4 v57.25,33.75 | MONITOR5.4 v69.25,33.75 | MONITOR6.4 v81.25,33.75 | MONITOR7.4 v93.25,33.75 | MONITOR8.4 v105.25,33.75 | IC3.7 v126.61,33.75 126,34.37 R5.1
  Bottom 0.254: v21.25,33.75 v33.25,33.75 v45.25,33.75 v57.25,33.75 v69.25,33.75 v81.25,33.75 v93.25,33.75 v105.25,33.75 v126.61,33.75 v148.25,33.75 v160,33.75 v172.5,33.75 v184.5,33.75 v196.25,33.75 v208.25,33.75 v220.25,33.75 v232.5,33.75
STATUS  (via drill 0.3)
  Top 0.305: IC1.3 120.2,17.2 v119,16 | v150,8 R13.2 | v152.5,8 152.5,6.92 LED1.C1
  Bottom 0.305: v119,16 119,11.75 121,9.75 148.25,9.75 v150,8 v152.5,8
SWCLK
  Top 0.305: IC1.24 121.8,8.45 122.5,7.75 124.75,7.75 127.77,4.73 J2.4
SWDIO
  Top 0.305: IC1.23 121,8.25 122.25,7 124.5,7 128.04,3.46 J2.2
USB_DM
  Top 0.305: U1.6 119.25,8.15 119.15,8.25 119.15,8.75 119.4,9 IC1.21
USB_DP
  Top 0.305: U1.4 120.25,8.15 120.35,8.25 120.35,8.75 120.2,8.9 IC1.22
VBUS  (via drill 0.3, 0.4)
  Top 0.305: U2.3 106.5,5.55 106.22,5.28 C1.1 | R15.2 8.75,19.1 R14.2 8.75,18.9 v8.75,17.5 | R26.2 20.75,19.1 R25.2 20.75,18.9 v20.75,17.5 | R36.2 32.75,19.1 R35.2 32.75,18.9 v32.75,17.5 | R31.2 44.75,19.1 | 44.75,19.1 R30.2 | v44.75,17.5 44.75,19.1 | R41.2 56.75,19.1 R40.2 56.75,18.9 v56.75,17.5 | R46.2 68.75,19.1 R45.2 68.75,18.9 v68.75,17.5 | R51.2 80.75,19.1 R50.2 80.75,18.9 v80.75,17.5 | R56.2 92.75,19.1 R55.2 92.75,18.9 v92.75,17.5 | R61.2 138.25,19.1 R60.2 138.25,18.9 v138.25,17.5 | R66.2 150.25,19.1 R65.2 150.25,18.9 v150.25,17.5 | R76.2 162.25,19.1 R75.2 162.25,18.9 v162.25,17.5 | R71.2 174.25,19.1 R70.2 174.25,18.9 v174.25,17.5 | R81.2 186.25,19.1 R80.2 186.25,18.9 v186.25,17.5 | R86.2 198.25,19.1 R85.2 198.25,18.9 v198.25,17.5 | R91.2 210.25,19.1 R90.2 210.25,18.9 v210.25,17.5 | R101.2 222.25,19.1 | 222.25,19.1 R100.2 | v222.25,17.5 222.25,19.1
  Top 0.406: C1.1 C4.1 | C4.1 106,7.7 v106,9 | U2.1 106.25,7.45 C4.1 | IC2.2 119.47,26.98 C2.1 119.95,26.5 v121.25,26.5
  Top 0.508: 106.22,5.28 106,5.05 106,3.75 105.25,3 101.44,3 F2.1
  Bottom 0.406: v106,9 106,16.25 104.75,17.5 v92.75,17.5 | v92.75,17.5 v80.75,17.5 v68.75,17.5 v56.75,17.5 v44.75,17.5 v32.75,17.5 v20.75,17.5 v8.75,17.5 | 117.25,17.5 v138.25,17.5 v150.25,17.5 v162.25,17.5 v174.25,17.5 v186.25,17.5 v198.25,17.5 v210.25,17.5 v222.25,17.5 | 117.25,17.5 v92.75,17.5 | v121.25,26.5 121.25,21.5 117.25,17.5
VCC  (via drill 0.3, 0.4)
  Top 0.305: IC1.17 116.2,8 C10.1 v114.75,8 | IC1.1 121.8,20 C11.1 122.25,20.1 v122.25,21.25 | IC1.5 118.6,20.75 C12.1 C14.1 116.5,20.85 v116.5,21.75 | IC3.1 C7.1 125.35,22.95 R4.2 v123.75,22.5 | J2.1 133.99,3.5 v136,3.5 | R8.2 v132,22.25 | R12.2 v154,8 | R3.2 v130.75,24.75 | v138.75,5.25 140.15,5.25 R11.2
  Top 0.406: U2.5 110.05,7.45 109.75,7.75 109.75,9.05 C5.1 | C5.1 109.75,9.45 v109.75,10.75 | C5.1 v108,9.25
  pour Bottom: 0,28 0,0 240,0 240,28
VCCISO  (via drill 0.3, 0.4)
  Top 0.203: MONITOR6.1 MONITOR6.2 78,32.75 77.5,33.25 77.5,34.25 | MONITOR7.1 91,32.25 v90.75,32 | MONITOR8.1 104.75,32.25 v105.25,31.75 | MONITOR10.2 161,32.75 v160,31.75 | MONITOR14.2 210.25,32.75 210.75,32.25 v210.75,32 | MONITOR2.2 30.5,32.75 29.5,33.75 29.5,34.25 | MONITOR5.1 66.5,32.25 65.5,33.25 65.5,34.25
  Top 0.254: MONITOR1.6 17.5,34.25 18.4,35.15 18.4,35.75 C13.1 18.5,36.35 v18.5,37.25 | MONITOR2.6 29.5,34.25 30.4,35.15 30.4,35.75 C15.1 30.5,36.35 v30.5,37.25 | MONITOR3.6 41.5,34.25 42.4,35.15 42.4,35.75 C17.1 42.5,36.35 v42.5,37.25 | MONITOR4.6 53.5,34.25 54.4,35.15 54.4,35.75 C16.1 54.5,36.35 v54.5,37.25 | MONITOR5.6 65.5,34.25 66.4,35.15 66.4,35.75 C18.1 66.5,36.35 v66.5,37.25 | MONITOR6.6 77.5,34.25 78.4,35.15 78.4,35.75 C19.1 78.5,36.35 v78.5,37.25 | MONITOR7.6 89.5,34.25 90.4,35.15 90.4,35.75 C20.1 90.5,36.35 v90.5,37.25 | MONITOR8.6 101.5,34.25 102.4,35.15 102.4,35.75 C21.1 102.5,36.35 v102.5,37.25 | MONITOR9.6 146.75,34.25 148,35.5 148,35.65 C22.1 148,36.35 v148,37.25 | MONITOR10.6 158.75,34.25 160,35.5 160,35.65 C23.1 160,36.35 v160,37.25 | MONITOR11.6 171,34.25 172,35.25 172,35.65 C25.1 172,36.35 v172,37.25 | MONITOR12.6 183,34.25 184,35.25 184,35.65 C24.1 184,36.35 v184,37.25 | MONITOR13.6 194.75,34.25 196,35.5 196,35.65 C26.1 196,36.35 v196,37.25 | MONITOR14.6 206.75,34.25 208,35.5 208,35.65 C27.1 208,36.35 v208,37.25 | MONITOR15.6 218.75,34.25 220,35.5 220,35.65 C28.1 220,36.35 v220,37.25 | MONITOR16.6 231,34.25 232,35.25 232,35.65 C30.1 232,36.35 v232,37.25 | C8.1 R10.2 123.6,36.6 124.6,37.6 R5.2 R6.2 R19.2 R7.2
  Top 0.305: IC3.8 125.34,33.16 125,33.5 C8.1 123.25,33.15 v123.25,32 | C3.1 111.4,38.35 R9.1
  Top 0.406: v110,38.25 109.75,38.25
  Top 0.508: v109.25,38.75 109.75,38.25 v109.25,37.75 | C3.1 v110,38.25 | F1.2 111.4,38.35
  pour Bottom: 0,31 240,31 240,50 0,50
VIN1
  Top 1.27: RELAY1.P$4 X1.2
VIN2
  Top 1.27: X2.2 RELAY2.P$4
VIN3
  Top 1.27: X3.2 RELAY3.P$4
VIN4
  Top 1.27: X4.2 RELAY4.P$4
VIN5
  Top 1.27: X5.2 RELAY5.P$4
VIN6
  Top 1.27: X6.2 RELAY6.P$4
VIN7
  Top 1.27: RELAY7.P$4 X7.2
VIN8
  Top 1.27: X8.2 RELAY8.P$4
VIN9
  Top 1.27: X9.2 RELAY9.P$4
VIN10
  Top 1.27: X10.2 RELAY10.P$4
VIN11
  Top 1.27: X11.2 RELAY11.P$4
VIN12
  Top 1.27: RELAY12.P$4 X12.2
VIN13
  Top 1.27: X13.2 RELAY13.P$4
VIN14
  Top 1.27: X14.2 RELAY14.P$4
VIN15
  Top 1.27: RELAY15.P$4 X15.2
VIN16
  Top 1.27: X16.2 RELAY16.P$4

## Text on the board
tStop: ISOLATED / POWER | Hochschule / Bonn-Rhein-Sieg | Institut für / Sicherheitsforschung | 1 | POWER | STATUS
bStop: V1 | L1 | V2 | L2 | V3 | L3 | V4 | L4 | V5 | L5 | V6 | L6 | V7 | L7 | V8 | L8 | |–– GROUND ––| | V9 | L9 | V10 | L10 | V11 | L11 | V12 | L12 | V13 | L13 | V14 | L14 | V15 | L15 | V16 | L16 | Standalone | Marcel Hasler, 2021 | Relay Board 2.0